# EAGLE schematic GIP-BH1750 (EAGLE 9.1.3)
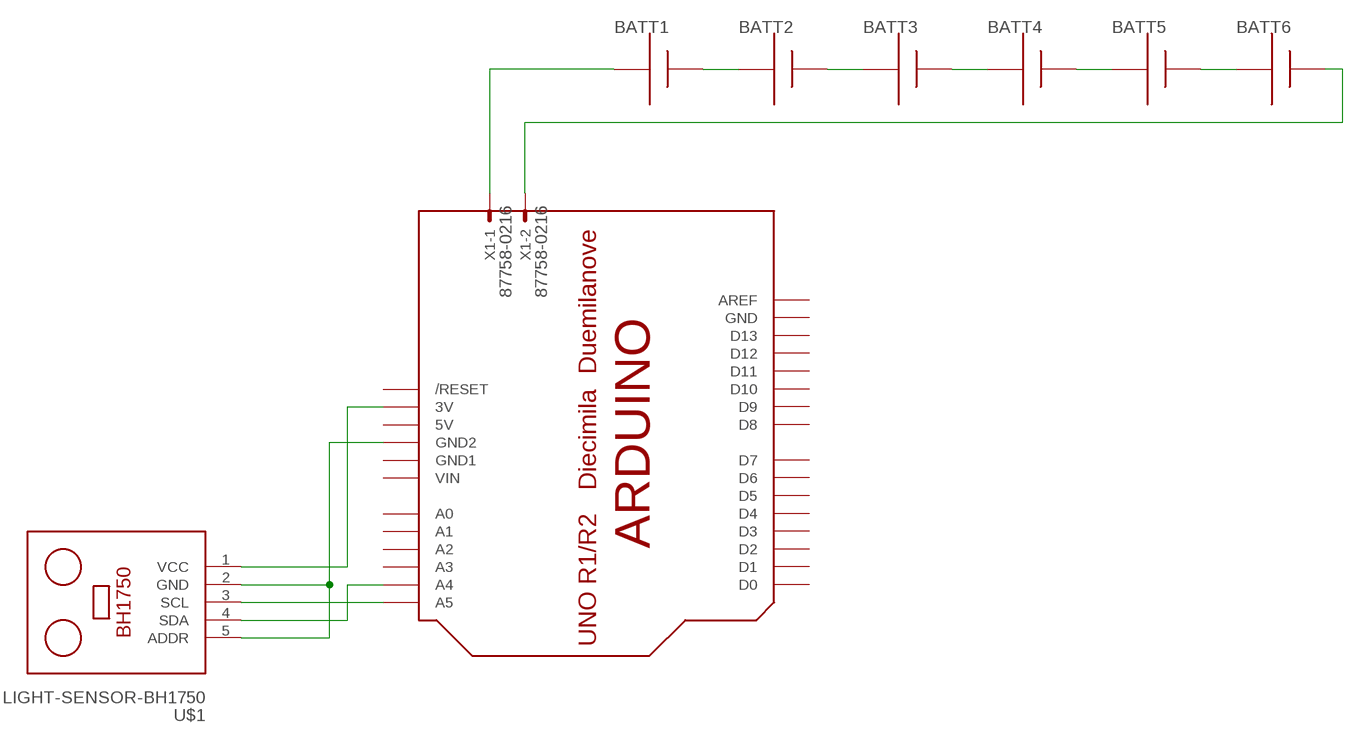
[diagram p0: schematic, sheet 1]

## Parts
BATT1  AAA  [12BH412]
BATT2  AAA  [12BH412]
BATT3  AAA  [12BH412]
BATT4  AAA  [12BH412]
BATT5  AAA  [12BH412]
BATT6  AAA  [12BH412]
U$1  LIGHT-SENSOR-BH1750  [LIGHT-SENSOR-BH1750]
U$2  ARDUINO-BPLACE  [ARDUINO-BPLACE]
X1  87758-0216  [87758-0216]

## Nets
N$1: U$1.3(SCL) U$2.A5
N$2: U$1.4(SDA) U$2.A4
N$3: U$1.1(VCC) U$2.3V
N$4: U$1.2(GND) U$1.5(ADDR) U$2.GND2
N$6: BATT1.+ BATT2.-
N$7: BATT2.+ BATT3.-
N$8: BATT3.+ BATT4.-
N$9: BATT4.+ BATT5.-
N$10: BATT5.+ BATT6.-
N$11: BATT1.- X1.1
N$12: BATT6.+ X1.2
Unconnected: U$2.A0 U$2.A1 U$2.A2 U$2.A3 U$2.AREF U$2.D0 U$2.D1 U$2.D2 U$2.D3 U$2.D4 U$2.D5 U$2.D6 U$2.D7 U$2.D8 U$2.D9 U$2.D10 U$2.D11 U$2.D12 U$2.D13 U$2.RESET(/RESET)

## Power pins joined to a net without a drawn wire
5V: U$2.5V
GND: U$2.GND
GND1: U$2.GND1
VIN: U$2.VIN

## Library data of the parts
BATT1-BATT6 = adafruit:AAA: AAA PC pin holder Mouser part #12BH412 - but pretty much any 1x AAA battery holder should be the same http://www.ladyada.net/library/pcb/eaglelibrary.html
U$1 = diy-modules:LIGHT-SENSOR-BH1750: Digital Light Sensor based on BH1750 BH1750 datasheet is available here: http://www.mouser.com/ds/2/348/bh1750fvi-e-186247.pdf Arduino Library for BH1750 is available here: https://github.com/claws/BH1750 Video Tutorial is available here: https://www.youtube.com/watch?v=UsLcHSbxf_8 Click here to find device on ebay.com <http://www.ebay.com/sch/bh1750fvi+module> Note: There are many variants. Search for the proper version.
U$2 = adafruit:ARDUINO: Arduino Diecimila/Duemilanove Make a shield with ease, this package has all the named pins as well as the two mounting drill holes and an outline of the USB and DC power connector. The outline is on the DIMENSION layer, so if your board house uses it they will cut the outline to match. http://www.ladyada.net/library/pcb/eaglelibrary.html
X1 = con-molex:87758-0216: 2 Pin - 2mm Dual Row Single Wafer, Vertical T/H HDR Source: http://www.molex.com/pdm_docs/sd/877580616_sd.pdf; MF: MOLEX; MPN: 87758-0216; OC_FARNELL: unknown; OC_NEWARK: 94M1513